# EasyEDA schematic P06_MODEM.json
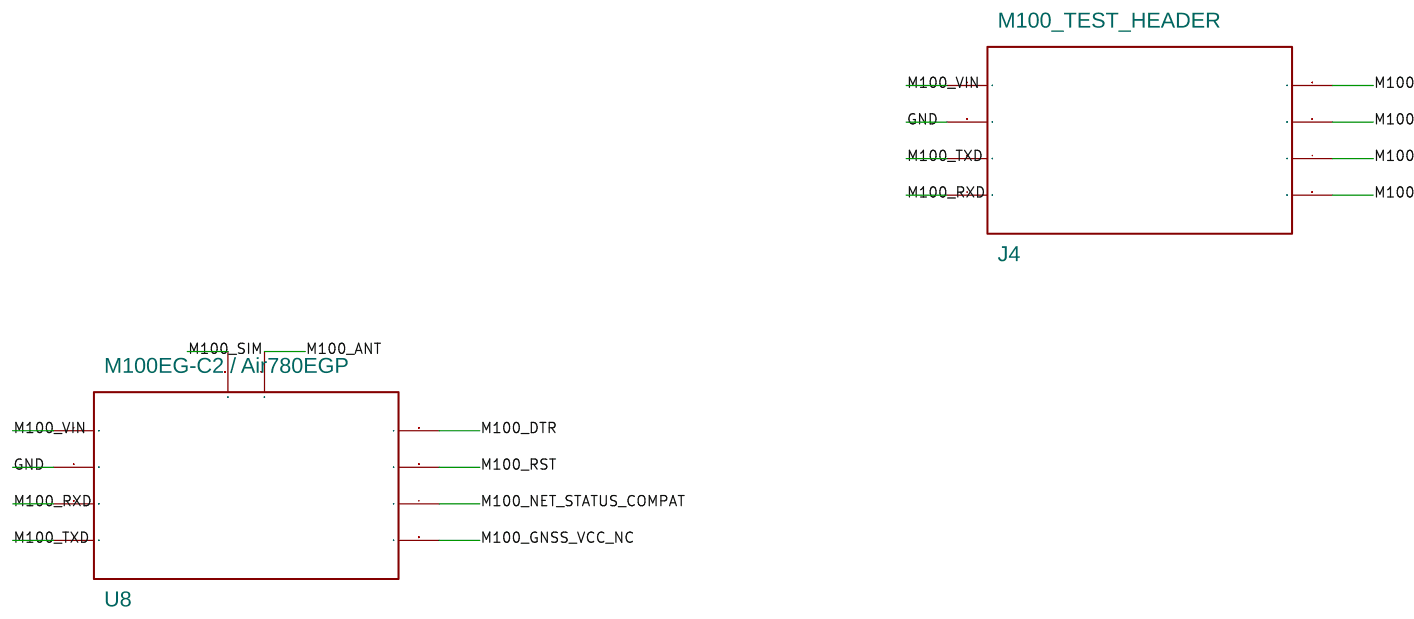
[diagram p0: schematic sheet]

## Parts
J4  M100_TEST_HEADER  [HDR-2.54-8P]
U8  M100EG-C2 / Air780EGP  [M100-CARRIER-25mm]

## Library data of the parts
J4 = Test_Header
U8 = Air780EGP_Carrier

## Nets
GND: J4.2(1) U8.2(1)
M100_ANT: U8.10(1)
M100_DTR: J4.5(1) U8.5(1)
M100_GNSS_VCC_NC: J4.8(1) U8.8(1)
M100_NET_STATUS_COMPAT: J4.7(1) U8.7(1)
M100_RST: J4.6(1) U8.6(1)
M100_RXD: J4.4(1) U8.3(1)
M100_SIM: U8.9(1)
M100_TXD: J4.3(1) U8.4(1)
M100_VIN: J4.1 U8.1

## Notes on the sheet
- P06  Air780EGP / M100EG-C2 载板、UART、DTR/RST 与测试点
- M100 VIN 只接 VBAT_SW（3.3–4.2V 电池轨），不能接 BQ_SYS 或 5V。
- RI/1PPS、载板 USB、NET_STATUS/GNSS_VCC 物理针脚按载板版本资料和实物确认。
- main_control gps.h 仅作信号名称交叉：旧 GPIO7/15/16/17/18/8 不直接复制。
- EWF：UART TX/RX=IO43/44，DTR=IO10，RST=IO15；IO16 兼容 NC/TP；GNSS_VCC 释放，IO8= BQ_OTG_EN。
- M100 RST 按低有效开漏候选落图，极性必须首块样机测量；载板 USB 仅测试点，不并入主 USB。
